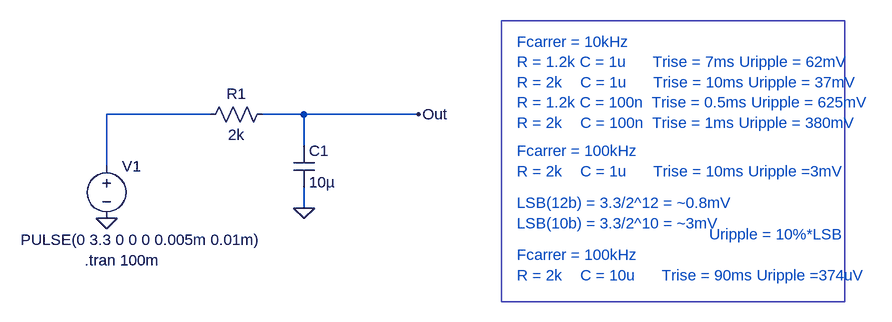
[diagram p0: schematic RC Filter tests.asc]
RC Filter tests.asc, the LTspice schematic file:
Version 4
SHEET 1 2100 680
WIRE 448 48 288 48
WIRE 592 48 528 48
WIRE 768 48 592 48
WIRE 592 96 592 48
WIRE 288 128 288 48
WIRE 592 192 592 160
FLAG 592 192 0
FLAG 288 208 0
FLAG 768 48 Out
SYMBOL voltage 288 112 R0
WINDOW 3 -132 129 Left 2
WINDOW 123 0 0 Left 0
WINDOW 39 0 0 Left 0
SYMATTR InstName V1
SYMATTR Value PULSE(0 3.3 0 0 0 0.005m 0.01m)
SYMBOL res 544 32 R90
WINDOW 0 0 56 VBottom 2
WINDOW 3 32 56 VTop 2
SYMATTR InstName R1
SYMATTR Value 2k
SYMBOL cap 576 96 R0
SYMATTR InstName C1
SYMATTR Value 10µ
TEXT 254 272 Left 2 !.tran 100m
TEXT 920 -64 Left 2 ;Fcarrer = 10kHz\nR = 1.2k C = 1u      Trise = 7ms Uripple = 62mV\nR = 2k    C = 1u      Trise = 10ms Uripple = 37mV\nR = 1.2k C = 100n  Trise = 0.5ms Uripple = 625mV\nR = 2k    C = 100n  Trise = 1ms Uripple = 380mV
TEXT 920 104 Left 2 ;Fcarrer = 100kHz\nR = 2k    C = 1u      Trise = 10ms Uripple =3mV
TEXT 920 184 Left 2 ;LSB(12b) = 3.3/2^12 = ~0.8mV\nLSB(10b) = 3.3/2^10 = ~3mV
TEXT 920 264 Left 2 ;Fcarrer = 100kHz\nR = 2k    C = 10u      Trise = 90ms Uripple =374uV
TEXT 1216 232 Left 2 ;Uripple = 10%*LSB
RECTANGLE Normal 1424 336 896 -96

The netlist it stands for:
* RC Filter tests.asc
V1 N001 0 PULSE(0 3.3 0 0 0 0.005m 0.01m)
R1 Out N001 2k
C1 Out 0 10µ
.tran 100m
* Fcarrer = 10kHz
* R = 1.2k C = 1u      Trise = 7ms Uripple = 62mV
* R = 2k    C = 1u      Trise = 10ms Uripple = 37mV
* R = 1.2k C = 100n  Trise = 0.5ms Uripple = 625mV
* R = 2k    C = 100n  Trise = 1ms Uripple = 380mV
* Fcarrer = 100kHz
* R = 2k    C = 1u      Trise = 10ms Uripple =3mV
* LSB(12b) = 3.3/2^12 = ~0.8mV
* LSB(10b) = 3.3/2^10 = ~3mV
* Fcarrer = 100kHz
* R = 2k    C = 10u      Trise = 90ms Uripple =374uV
* Uripple = 10%*LSB
.backanno
.end